# EAGLE schematic prototype (EAGLE 9.6.2)
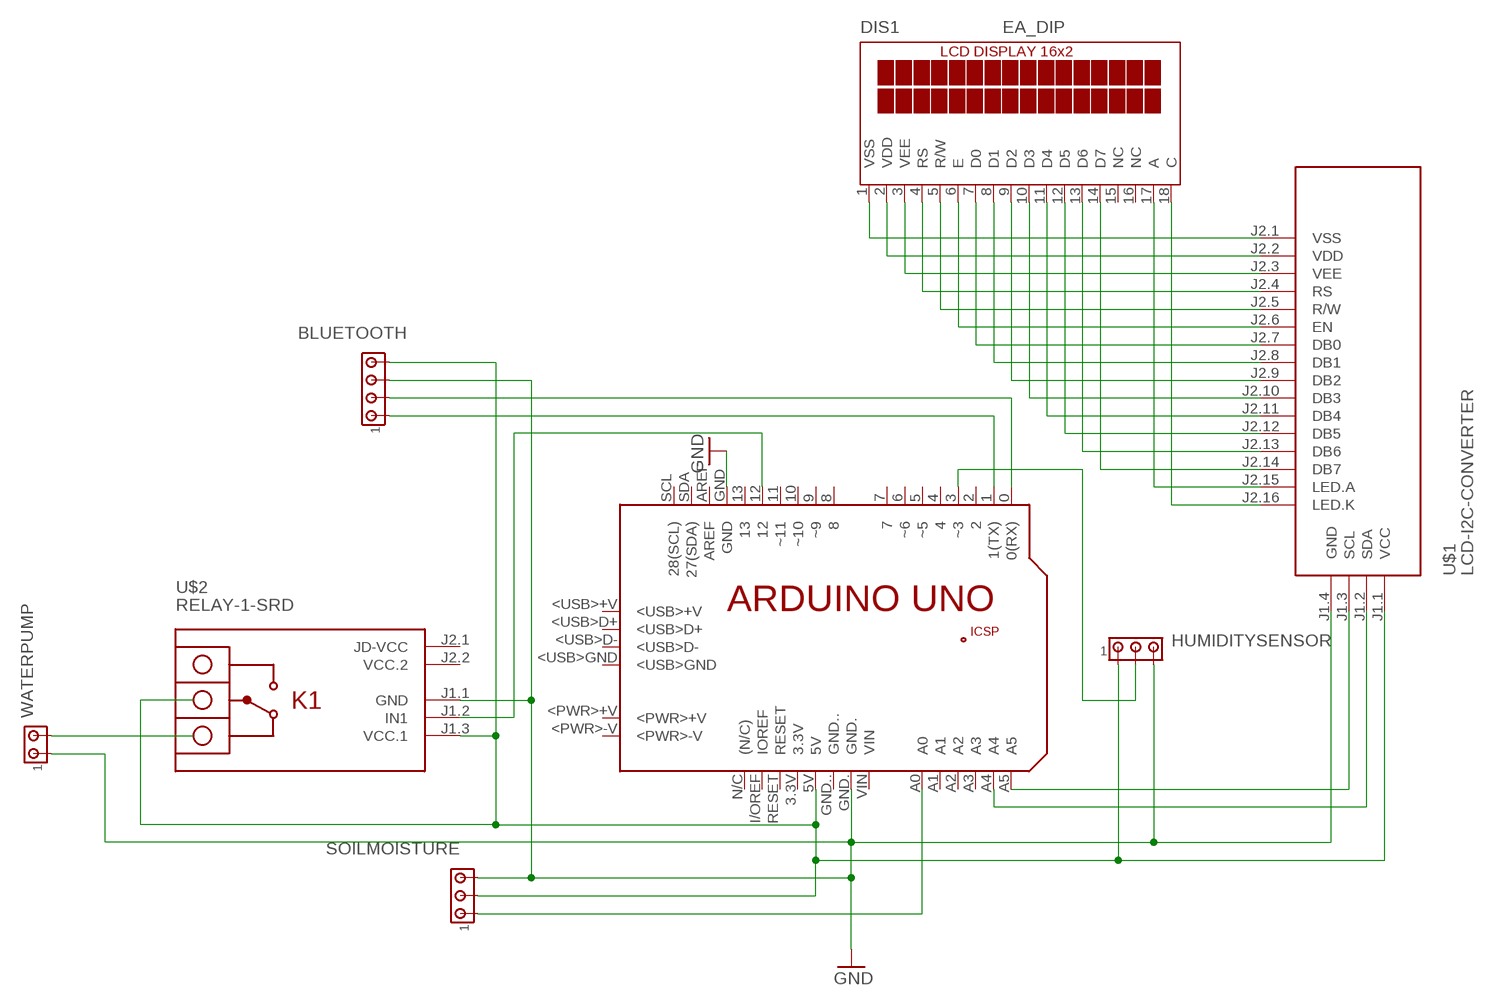
[diagram p0: schematic, sheet 1]

## Parts
BLUETOOTH  MTA04-100  [10X04MTA]
DIS1  EA_DIP  [EA_DIP]
HUMIDITYSENSOR  MTA03-100  [10X03MTA]
PCB1  ARDUINO_UNO  [ARDUINO_UNO]
SOILMOISTURE  MTA03-100  [10X03MTA]
U$1  LCD-I2C-CONVERTER  [LCD-I2C-CONVERTER]
U$2  RELAY-1-SRD  [RELAY-1-SRD]
WATERPUMP  MTA02-100  [10X02MTA]

## Nets
GND: BLUETOOTH.3 HUMIDITYSENSOR.3 PCB1.GND PCB1.GND. SOILMOISTURE.3 U$1.J1.4(GND) U$2.J1.1(GND) WATERPUMP.1
N$1: DIS1.1(VSS) DIS1.4(RS) U$1.J2.1(VSS) U$1.J2.4(RS)
N$2: DIS1.2(VDD) U$1.J2.2(VDD)
N$3: DIS1.3(VEE) U$1.J2.3(VEE)
N$4: DIS1.5(R/W) U$1.J2.5(R/W)
N$5: DIS1.6(E) U$1.J2.6(EN)
N$6: DIS1.7(D0) U$1.J2.7(DB0)
N$7: DIS1.8(D1) U$1.J2.8(DB1)
N$8: DIS1.9(D2) U$1.J2.9(DB2)
N$9: DIS1.10(D3) U$1.J2.10(DB3)
N$10: DIS1.11(D4) U$1.J2.11(DB4)
N$11: DIS1.12(D5) U$1.J2.12(DB5)
N$12: DIS1.13(D6) U$1.J2.13(DB6)
N$13: DIS1.14(D7) U$1.J2.14(DB7)
N$14: DIS1.17(A) U$1.J2.15(LED.A)
N$15: DIS1.18(C) U$1.J2.16(LED.K)
N$16: BLUETOOTH.4 HUMIDITYSENSOR.1 PCB1.5V SOILMOISTURE.2 U$1.J1.1(VCC) U$2.J1.3(VCC.1)
N$18: PCB1.A5 U$1.J1.3(SCL)
N$19: PCB1.A4 U$1.J1.2(SDA)
N$20: HUMIDITYSENSOR.2 PCB1.3(~3)
N$21: PCB1.A0 SOILMOISTURE.1
N$22: WATERPUMP.2
N$23: PCB1.12 U$2.J1.2(IN1)
N$25: BLUETOOTH.2 PCB1.0(0(RX))
N$26: BLUETOOTH.1 PCB1.1(1(TX))
Unconnected: DIS1.15(NC) DIS1.16(NC) PCB1.2 PCB1.3.3V PCB1.4 PCB1.5(~5) PCB1.6(~6) PCB1.7 PCB1.8 PCB1.9(~9) PCB1.10(~10) PCB1.11(~11) PCB1.13 PCB1.+5V PCB1.<PWR>+V PCB1.<PWR>-V PCB1.<USB>+V PCB1.<USB>D+ PCB1.<USB>D- PCB1.<USB>GND PCB1.A1 PCB1.A2 PCB1.A3 PCB1.AREF PCB1.GND.. PCB1.GND_ PCB1.I/OREF(IOREF) PCB1.MISO PCB1.MOSI PCB1.N/C((N/C)) PCB1.RESET PCB1.RESET. PCB1.SCK PCB1.SCL(28(SCL)) PCB1.SDA(27(SDA)) PCB1.VIN U$2.J2.1(JD-VCC)

## Power pins joined to a net without a drawn wire
VCC.2: U$2.J2.2(VCC.2)

## Library data of the parts
BLUETOOTH = con-amp:MTA04-100: AMP connector
DIS1 = display-lcd:EA_DIP: LCD-MODUL 2x16 - 6,68mm, INKL. KONTROLLER HD44780 Source: Data sheet <http://www.lcd-module.de/pdf/doma/dip162-d.pdf>
HUMIDITYSENSOR SOILMOISTURE = con-amp:MTA03-100: AMP connector
PCB1 = Arduino_Shield:ARDUINO_UNO: Device for representing an Arduino Uno board with a footprint in an EAGLE design. Created by Dave Young for Element14. More EAGLE documentation at: http://www.element14.com/community/community/knode/cadsoft_eagle
U$1 = diy-modules:LCD-I2C-CONVERTER: I2C Bus to 4-Bit Parallel LCD Interface with LED backlight driver
U$2 = diy-modules:RELAY-1-SRD: 1-Channel Relay Module based on SRD-05VDC-SL-C relays Click here to find device on ebay.com <http://www.ebay.com/sch/one+channel+isolated+relay+5v>
WATERPUMP = con-amp:MTA02-100: AMP connector